# Altium schematic sheet Volant5.Push_button_v1.0.SchDoc
size A
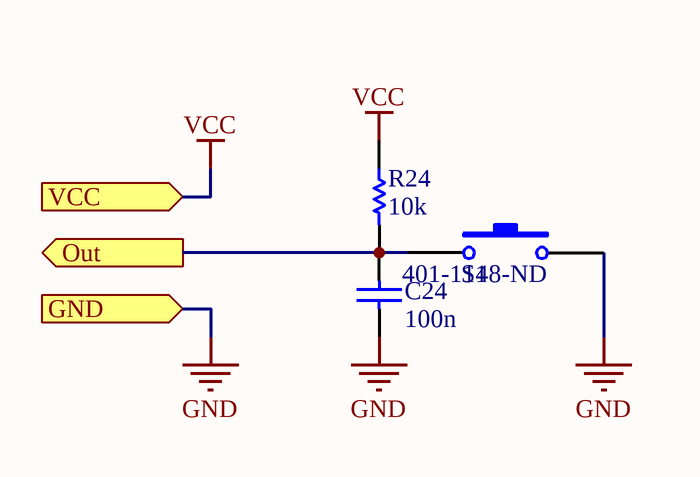
[diagram p0: Volant5.Push_button_v1.0.SchDoc]

## Parts
C24  value 100n  [CS-0603]  (hidden comment: CS - CAPACITOR)
R24  value 10k  [RS-0603]  (hidden comment: RS - RESISTOR)
S1  Cap black: 401-1148-ND  [SW-ESE20C443]  (hidden comment: SW - Tactile Switch)

## Ports
GND (in), Out (out), VCC (in)

## Nets
GND: C24.1 S1.2 ; port GND
VCC: R24.1 ; port VCC
Out: C24.2 R24.2 S1.1 ; port Out

## Library data of the parts
C24 = CS - CAPACITOR: VOLTAGE: 16V; TOLERANCE: 10%; Supplier 1: *; Supplier Part Number 1: 490-1532-1-ND; (FIELD A): *; (FLIED C): *; (FIELD B): *; Manufacturer: *
R24 = RS - RESISTOR: POWER: RES POWER; TOLERANCE: RES TOL; Supplier Part Number 1: RHM10.0KCFCT-ND; Supplier 1: *; (FIELD A): *; (FLIED C): *; (FIELD B): *; Manufacturer: *
S1 = SW - Tactile Switch: Supplier 1: Digi-Key; Supplier Part Number 1: 450-1658-ND; (FLIED B): *; (FLIED C): *; Manufacturer: *; Supplier 2: Digi-Key; Supplier Part Number 2: 450-1758-2-ND; Supplier Part Number 3: P12347S-ND